# Altium schematic sheet accero_humid_rtc.SchDoc: Opo
size Letter; Author: William Huang; Engineer: William Huang; Revision: 3.0
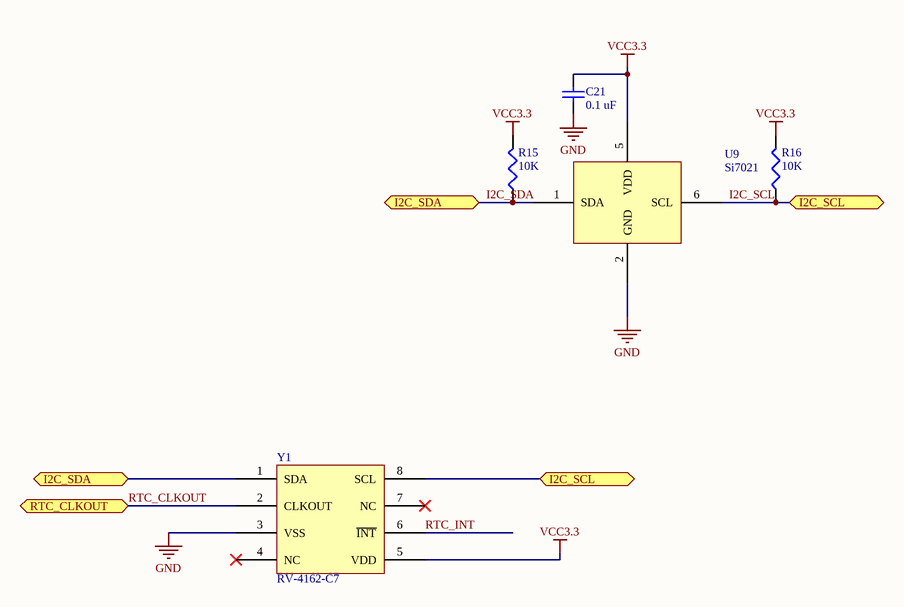
[diagram p0: accero_humid_rtc.SchDoc]

## Parts
C21  value 0.1 uF  [0402]  (hidden comment: Ceramic capacitor)
R15  value 10K  [0402]  (hidden comment: Chip resistor)
R16  value 10K  [0402]  (hidden comment: Chip resistor)
U9  Si7021  [DFN6-Si7021]
Y1  RV-4162-C7  [RV4162]

## Ports
I2C_SCL, I2C_SDA, RTC_CLKOUT

## Nets
GND: C21.2 U9.2(GND) Y1.3(VSS)
VCC3.3: C21.1 R15.1 R16.1 U9.5(VDD) Y1.5(VDD)
I2C_SCL: R16.2 U9.6(SCL) Y1.8(SCL) ; port I2C_SCL
I2C_SDA: R15.2 U9.1(SDA) Y1.1(SDA) ; port I2C_SDA
RTC_CLKOUT: Y1.2(CLKOUT) ; port RTC_CLKOUT
RTC_INT: Y1.6(~{INT})

Not connected (* = marked no-connect by the designer): U9 3(DNC) 4(DNC) 7(DNC); Y1 4(NC)* 7(NC)*

## Notes on the sheet
- Title
- Date:
- Author:
- Revision:
- Sheet
- of
- University of Michigan
- File:

## Library data of the parts
C21 = C_0.1u_0402_ceramic: Ceramic capacitor, 0.1u, 0402 package; Manufacture: TDK; voltage rated: 10 V; tolerance: 10%; Supplier 1: Digi-Key; Supplier Part Number 1: 445-1265-1-ND; package: 0402
R15 R16 = R_10K_0402: Chip resistor, 10K, 0402 package; tolerance: 1%; power: 1/16 W; Supplier 1: Digi-Key; Supplier Part Number 1: 541-10.0KLDKR-ND; package: 0402
U9 = Si7021: Temperature and Humidity Sensor; Supplier 1: Digikey; Supplier Part Number 1: 336-2542-1-ND
Y1 = RV-4162-C7: Real Time Clock Module with I2C Bus; Supplier 1: Newark; Supplier Part Number 1: 09X0517